# Altium schematic sheet Sheet2.SchDoc
size A4
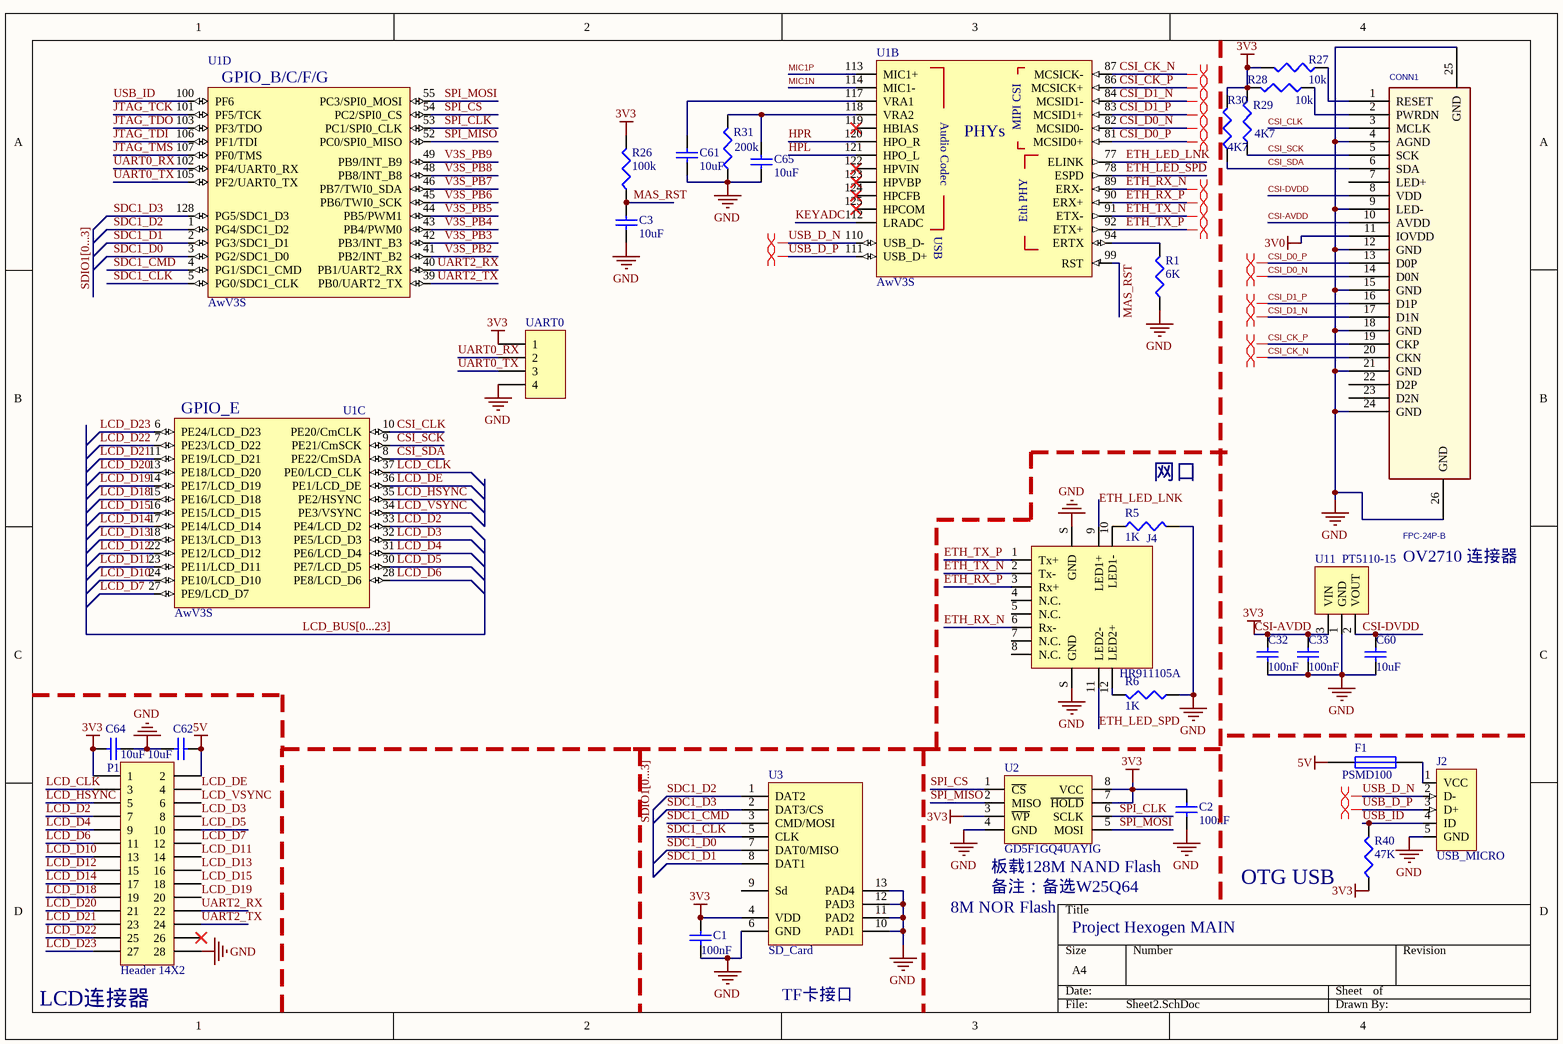
[diagram p0: Sheet2.SchDoc]

## Parts
C1  value 100nF  [0603C]  (hidden comment: 104)
C2  value 100nF  [0603C]  (hidden comment: 104)
C3  value 10uF  [0603C]  (hidden comment: 106)
C32  value 100nF  [0603C]  (hidden comment: 104)
C33  value 100nF  [0603C]  (hidden comment: 104)
C60  value 10uF  [0603C]  (hidden comment: 106)
C61  value 10uF  [0603C]  (hidden comment: 106)
C62  value 10uF  [0603C]  (hidden comment: 106)
C64  value 10uF  [0603C]  (hidden comment: 106)
C65  value 10uF  [0603C]  (hidden comment: 106)
CONN1  FPC-24P-B  [FPC-24P-0.5]
F1  PSMD100  [0805R]
J2  USB_MICRO  [MicroUSB]
J4  HR911105A  [HR911105A]
P1  Header 14X2  [HDR2X14]
R1  6K  [0603R]
R5  1K  [0603R]
R6  1K  [0603R]
R26  100k  [0603R]
R27  10K  [0603R]
R28  10K  [0603R]
R29  4K7  [0603R]
R30  4K7  [0603R]
R31  200K  [0603R]
R40  47K  [0603R]
U1  AwV3S  [ELQFP128E0MM4F7MM8]  (parts B,C,D of 4)
U2  GD5F1GQ4UAYIG  [TSOP8+WSON8-6X5]
U3  SD_Card  [TF_self-eject]
U11  PT5110-15  [SOT-23]
UART0  Header 4  [HDR1X4]  (value not drawn)

## Nets
3V0: CONN1.11(IOVDD)
5V: C62.1 F1.1 P1.2
CSI-AVDD: C1.1 C2.1 C32.2 C33.2 C64.2 CONN1.10(AVDD) P1.1 R26.2 R27.2 R28.2 R29.2 R30.2 R40.1 U2.3(~{WP}) U2.7(~{HOLD}) U2.8(VCC) U3.4(VDD) U11.3(VIN) UART0.1  [also labelled 3V3]
GND: C1.2 C2.2 C3.2 C32.1 C33.1 C60.1 C61.2 C62.2 C64.1 C65.2 CONN1.4(AGND) CONN1.9(LED-) CONN1.12(GND) CONN1.15(GND) CONN1.18(GND) CONN1.21(GND) CONN1.24(GND) CONN1.25(GND) CONN1.26(GND) J2.5(GND) J4.S(GND) P1.28 R1.1 R5.2 R6.1 R31.1 U2.4(GND) U3.6(GND) U3.10(PAD1) U3.11(PAD2) U3.12(PAD3) U3.13(PAD4) U11.1(GND) UART0.4
CSI-DVDD: C60.2 CONN1.8(VDD) U11.2(VOUT)
CSI_CK_N: CONN1.20(CKN) U1.87(MCSICK-)
CSI_CK_P: CONN1.19(CKP) U1.86(MCSICK+)
CSI_CLK: CONN1.3(MCLK) U1.10(PE20/CmCLK)
CSI_D0_N: CONN1.14(D0N) U1.82(MCSID0-)
CSI_D0_P: CONN1.13(D0P) U1.81(MCSID0+)
CSI_D1_N: CONN1.17(D1N) U1.84(MCSID1-)
CSI_D1_P: CONN1.16(D1P) U1.83(MCSID1+)
CSI_SCK: CONN1.5(SCK) R29.1 U1.9(PE21/CmSCK)
CSI_SDA: CONN1.6(SDA) R30.1 U1.8(PE22/CmSDA)
ETH_LED_LNK: J4.9(LED1+) U1.77(ELINK)
ETH_LED_SPD: J4.11(LED2-) U1.78(ESPD)
ETH_RX_N: J4.6(Rx-) U1.89(ERX-)
ETH_RX_P: J4.3(Rx+) U1.90(ERX+)
ETH_TX_N: J4.2(Tx-) U1.91(ETX-)
ETH_TX_P: J4.1(Tx+) U1.92(ETX+)
HPL: U1.121(HPO_L)
HPR: U1.120(HPO_R)
JTAG_TCK: U1.101(PF5/TCK)
JTAG_TDI: U1.106(PF1/TDI)
JTAG_TDO: U1.103(PF3/TDO)
JTAG_TMS: U1.107(PF0/TMS)
KEYADC: U1.112(LRADC)
LCD_CLK: P1.3 U1.37(PE0/LCD_CLK)
LCD_D2: P1.7 U1.33(PE4/LCD_D2)
LCD_D3: P1.8 U1.32(PE5/LCD_D3)
LCD_D4: P1.9 U1.31(PE6/LCD_D4)
LCD_D5: P1.10 U1.30(PE7/LCD_D5)
LCD_D6: P1.11 U1.28(PE8/LCD_D6)
LCD_D7: P1.12 U1.27(PE9/LCD_D7)
LCD_D10: P1.13 U1.24(PE10/LCD_D10)
LCD_D11: P1.14 U1.23(PE11/LCD_D11)
LCD_D12: P1.15 U1.22(PE12/LCD_D12)
LCD_D13: P1.16 U1.18(PE13/LCD_D13)
LCD_D14: P1.17 U1.17(PE14/LCD_D14)
LCD_D15: P1.18 U1.16(PE15/LCD_D15)
LCD_D18: P1.19 U1.15(PE16/LCD_D18)
LCD_D19: P1.20 U1.14(PE17/LCD_D19)
LCD_D20: P1.21 U1.13(PE18/LCD_D20)
LCD_D21: P1.23 U1.11(PE19/LCD_D21)
LCD_D22: P1.25 U1.7(PE23/LCD_D22)
LCD_D23: P1.27 U1.6(PE24/LCD_D23)
LCD_DE: P1.4 U1.36(PE1/LCD_DE)
LCD_HSYNC: P1.5 U1.35(PE2/HSYNC)
LCD_VSYNC: P1.6 U1.34(PE3/VSYNC)
MAS_RST: C3.1 R26.1 U1.99(RST)
MIC1N: U1.114(MIC1-)
MIC1P: U1.113(MIC1+)
SDC1_CLK: U1.5(PG0/SDC1_CLK) U3.5(CLK)
SDC1_CMD: U1.4(PG1/SDC1_CMD) U3.3(CMD/MOSI)
SDC1_D0: U1.3(PG2/SDC1_D0) U3.7(DAT0/MISO)
SDC1_D1: U1.2(PG3/SDC1_D1) U3.8(DAT1)
SDC1_D2: U1.1(PG4/SDC1_D2) U3.1(DAT2)
SDC1_D3: U1.128(PG5/SDC1_D3) U3.2(DAT3/CS)
SPI_CLK: U1.53(PC1/SPI0_CLK) U2.6(SCLK)
SPI_CS: U1.54(PC2/SPI0_CS) U2.1(~{CS})
SPI_MISO: U1.52(PC0/SPI0_MISO) U2.2(MISO)
SPI_MOSI: U1.55(PC3/SPI0_MOSI) U2.5(MOSI)
UART0_RX: U1.102(PF4/UART0_RX) UART0.2
UART0_TX: U1.105(PF2/UART0_TX) UART0.3
UART2_RX: P1.22 U1.40(PB1/UART2_RX)
UART2_TX: P1.24 U1.39(PB0/UART2_TX)
USB_D_N: J2.2(D-) U1.110(USB_D-)
USB_D_P: J2.3(D+) U1.111(USB_D+)
USB_ID: J2.4(ID) R40.2 U1.100(PF6)
V3S_PB2: U1.41(PB2/INT_B2)
V3S_PB3: U1.42(PB3/INT_B3)
V3S_PB4: U1.43(PB4/PWM0)
V3S_PB5: U1.44(PB5/PWM1)
V3S_PB6: U1.45(PB6/TWI0_SCK)
V3S_PB7: U1.46(PB7/TWI0_SDA)
V3S_PB8: U1.48(PB8/INT_B8)
V3S_PB9: U1.49(PB9/INT_B9)
NetC61_1: C61.1 U1.117(VRA1)
NetC65_1: C65.1 R31.2 U1.118(VRA2)
NetCONN1_1: CONN1.1(RESET) R27.1
NetCONN1_2: CONN1.2(PWRDN) R28.1
NetF1_2: F1.2 J2.1(VCC)
NetJ4_10: J4.10(LED1-) R5.1
NetJ4_12: J4.12(LED2+) R6.2
NetR1_2: R1.2 U1.94(ERTX)

Not connected (* = marked no-connect by the designer): CONN1 7(LED+) 22(D2P) 23(D2N); J4 4(N.C.) 5(N.C.) 7(N.C.) 8(N.C.); P1 26*; U1 119(HBIAS)* 122(HPVIN)* 123(HPVBP)* 124(HPCFB)* 125(HPCOM)*; U3 9(Sd)

## Buses and harness runs
bus LCD_BUS[0...23]
bus SDIO1[0...3]

## Layout directives
differential pair: CSI_CK_N, CSI_CK_P, CSI_D0_N, CSI_D0_P, CSI_D1_N, CSI_D1_P, ETH_RX_N, ETH_RX_P, ETH_TX_N, ETH_TX_P, USB_D_N, USB_D_P

## Notes on the sheet
- (near R5) 网口
- OV2710 连接器
- 8M NOR Flash
- (near U2) 板载128M NAND Flash
- (near U2) 备注：备选W25Q64
- Project Hexogen MAIN
- OTG USB
- (near P1) LCD连接器
- TF卡接口
- (in symbol Aw_V3S, part B) Audio Codec; MIPI CSI; PHYs; Eth PHY; USB
- (in symbol Aw_V3S, part C) GPIO_E
- (in symbol Aw_V3S, part D) GPIO_B/C/F/G

## Library data of the parts
C1 C32 C33 C60 C62 C64 = Cap: Capacitor; Published: 8-Jun-2000; LatestRevisionDate: 17-Jul-2002; LatestRevisionNote: Re-released for DXP Platform.; PackageReference: RAD-0.3; Publisher: Altium Limited; PackageDescription: Radial Cap, Thru-Hole; 2 Leads; 0.3 in Pin Spacing
C2 C3 C61 C65 = Cap: 0603 Ceramic Capacitor; Published: 8-Jun-2000; LatestRevisionDate: 17-Jul-2002; LatestRevisionNote: Re-released for DXP Platform.; PackageReference: RAD-0.3; Publisher: Altium Limited; PackageDescription: Radial Cap, Thru-Hole; 2 Leads; 0.3 in Pin Spacing
CONN1 = TD030673_2: FPC Connector 0.4mm Pitch; Page: 10
F1 = Fuse 1: 6V 1A PTC Fuse; Published: 8-Jun-2000; LatestRevisionDate: 17-Jul-2002; LatestRevisionNote: Re-released for DXP Platform.; PackageReference: PIN-W2/E2.8; Publisher: Altium Limited; PackageDescription: Thru-Hole; 2 Leads
J2 = USB_MICRO: OTG USB By V3S
J4 = HR911105A: HanRun 911105A  ETH Jack
P1 = Header 14X2: Header, 14-Pin, Dual row; LatestRevisionDate: 17-Jul-2002; LatestRevisionNote: Re-released for DXP Platform.; Publisher: Altium Limited
R1 R5 R6 R26-R31 R40 = Res3: Resistor; Published: 8-Jun-2000; LatestRevisionDate: 29-May-2009; LatestRevisionNote: IPC-7351 Footprint Added.; PackageReference: J1-0603; Publisher: Altium Limited; PackageDescription: Chip Resistor
  R1: Value: 6K
  R5 R6: Value: 1K
  R26: Value: 100k
  R27 R28: Value: 10k
  R29 R30: Value: 4K7
  R31: Value: 200k
  R40: Value: 47K
U1 = Aw_V3S
U2 = W25Qxx: 128MB NAND Flash WSON8
U11 = PT5110
UART0 = Header 4: Header, 4-Pin; LatestRevisionDate: 17-Jul-2002; LatestRevisionNote: Re-released for DXP Platform.; Publisher: Altium Limited